# EAGLE design Basic_health_version_II (EAGLE 8.2.2)
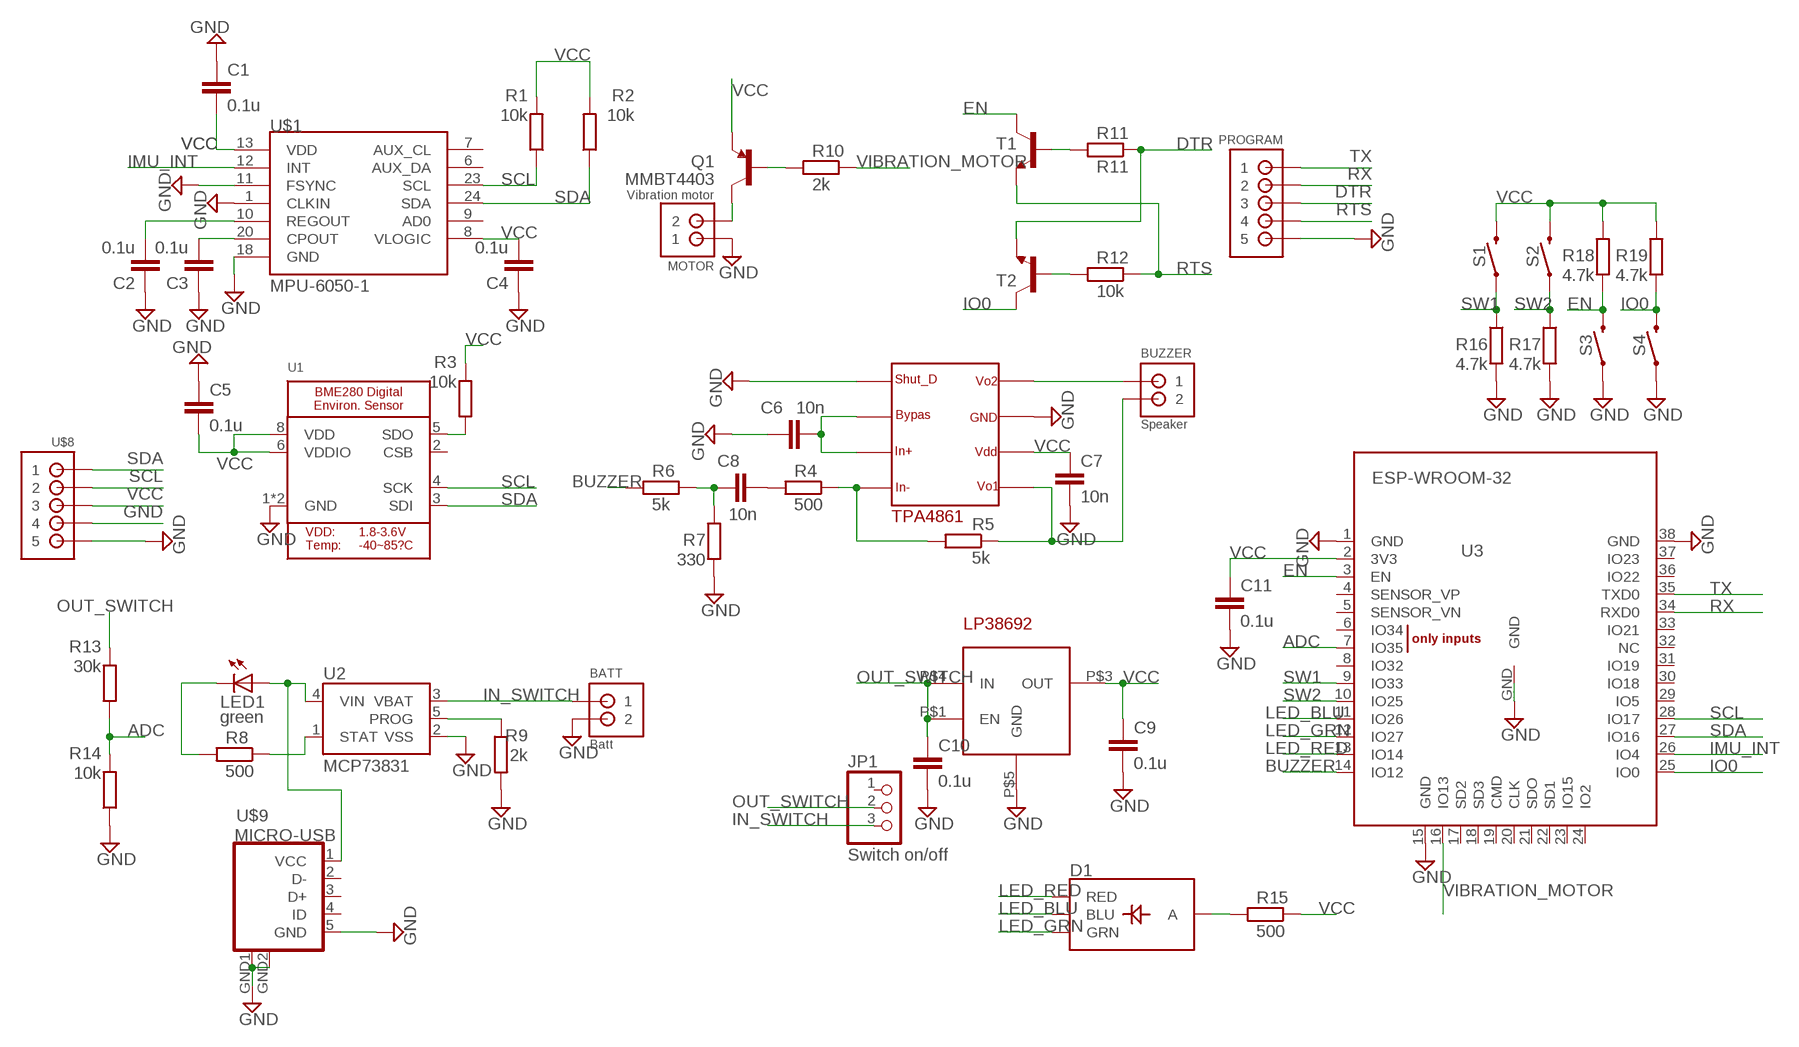
[diagram p0: schematic, sheet 1]

## Parts
BATT  Batt  JST-PH_2-PIN_HEADER  [JST_B2B-PH_HEADER]
BUZZER  Speaker  JST-PH_2-PIN_HEADER  [JST_B2B-PH_HEADER]
C1  0.1u  C-EUC0603K  [C0603K]
C2  0.1u  C-EUC0603K  [C0603K]
C3  0.1u  C-EUC0603K  [C0603K]
C4  0.1u  C-EUC0603K  [C0603K]
C5  0.1u  C-EUC0603K  [C0603K]
C6  10n  C-EUC0603K  [C0603K]
C7  10n  C-EUC0603K  [C0603K]
C8  10n  C-EUC0603K  [C0603K]
C9  0.1u  C-EUC0603K  [C0603K]
C10  0.1u  C-EUC0603K  [C0603K]
C11  0.1u  C-EUC0603K  [C0603K]
D1  LED-RGB-CASMD  [LED-TRICOLOR-SMD]
JP1  Switch on/off  PINHD-1X3  [1X03]
LED1  green  LEDCHIPLED_0805  [CHIPLED_0805]
MOTOR  Vibration motor  JST-PH_2-PIN_HEADER  [JST_B2B-PH_HEADER]
PROGRAM  Program port  JST-PH_5-PIN_HEADER  [JST_B5B-PH_HEADER]
Q1  MMBT4403  TRANSISTOR_PNPMMBT4403  [SOT23-3]
R1  10k  R-EU_R0603  [R0603]
R2  10k  R-EU_R0603  [R0603]
R3  10k  R-EU_R0603  [R0603]
R4  500  R-EU_R0603  [R0603]
R5  5k  R-EU_R0603  [R0603]
R6  5k  R-EU_R0603  [R0603]
R7  330  R-EU_R0603  [R0603]
R8  500  R-EU_R0603  [R0603]
R9  2k  R-EU_R0603  [R0603]
R10  2k  R-EU_R0603  [R0603]
R11  R11  R-EU_R0603  [R0603]
R12  10k  R-EU_R0603  [R0603]
R13  30k  R-EU_R0603  [R0603]
R14  10k  R-EU_R0603  [R0603]
R15  500  R-EU_R0603  [R0603]
R16  4.7k  R-EU_R0603  [R0603]
R17  4.7k  R-EU_R0603  [R0603]
R18  4.7k  R-EU_R0603  [R0603]
R19  4.7k  R-EU_R0603  [R0603]
S1  MOMENTARY-SWITCH-SPST-PTH-RIGHT-ANGLE  [TACTILE_SWITCH_PTH_RIGHT_ANGLE]
S2  MOMENTARY-SWITCH-SPST-PTH-RIGHT-ANGLE  [TACTILE_SWITCH_PTH_RIGHT_ANGLE]
S3  MOMENTARY-SWITCH-SPST-PTH-RIGHT-ANGLE  [TACTILE_SWITCH_PTH_RIGHT_ANGLE]
S4  MOMENTARY-SWITCH-SPST-PTH-RIGHT-ANGLE  [TACTILE_SWITCH_PTH_RIGHT_ANGLE]
T1  BC817-16-NPN-SOT23-BEC  [SOT23-BEC]
T2  BC817-16-NPN-SOT23-BEC  [SOT23-BEC]
U1  BME280  [BME280]
U2  MCP73831  [SOT23-5]
U3  ESP-WROOM-32  [ESP-WROOM-32]
U$1  MPU-6050-1  [QFN-24-4MM2]
U$2  TPA4861  [SOIC8]
U$5  LP38692_3.3V  [SOT-223-4]
U$8  JST-PH_5-PIN_HEADER  [JST_B5B-PH_HEADER]
U$9  MICRO-USB  [MICRO-USB]

## Nets
ADC: R13.1 R14.2 U3.7(IO35)
BUZZER: R6.2 U3.14(IO12)
DTR: PROGRAM.P3 R11.1 T2.E
EN: R18.2 S3.2 T1.C U3.3(EN)
GND: BATT.P2 C1.1 C2.1 C3.1 C4.1 C5.1 C6.2 C7.2 C9.2 C10.2 C11.2 MOTOR.P1 PROGRAM.P5 R7.2 R9.2 R14.1 R16.2 R17.2 S3.1 S4.1 U1.1(GND) U1.7(GND) U2.2(VSS) U3.1(GND) U3.15(GND) U3.38(GND) U3.GND U$1.1(CLKIN) U$1.11(FSYNC) U$1.18(GND) U$2.P$1 U$2.P$7 U$5.P$5(GND) U$8.P4 U$8.P5 U$9.5(GND) U$9.GND1(GND) U$9.GND2(GND)
IMU_INT: U3.26(IO4) U$1.12(INT)
IN_SWITCH: BATT.P1 JP1.3 U2.3(VBAT)
IO0: R19.2 S4.2 T2.C U3.25(IO0)
LED_BLU: D1.B(BLU) U3.11(IO26)
LED_GRN: D1.G(GRN) U3.12(IO27)
LED_RED: D1.R(RED) U3.13(IO14)
N$2: C6.1 U$2.P$2 U$2.P$3
N$3: R3.1 U1.5(SDO)
N$5: C3.2 U$1.20(CPOUT)
N$6: C2.2 U$1.10(REGOUT)
N$7: R4.1 R5.2 U$2.P$4
N$8: C8.2 R4.2
N$10: BUZZER.P2 R5.1 U$2.P$5
N$11: BUZZER.P1 U$2.P$8
N$12: C8.1 R6.1 R7.1
N$13: LED1.A U2.4(VIN) U$9.1(VCC)
N$14: LED1.C R8.2
N$15: R8.1 U2.1(STAT)
N$16: R9.1 U2.5(PROG)
N$17: Q1.1(B) R10.2
N$18: MOTOR.P2 Q1.3(C)
N$19: R12.2 T2.B
N$20: R11.2 T1.B
N$21: D1.A R15.2
OUT_SWITCH: C10.1 JP1.2 R13.2 U$5.P$1(EN) U$5.P$4(IN)
RTS: PROGRAM.P4 R12.1 T1.E
RX: PROGRAM.P2 U3.34(RXD0)
SCL: R1.1 U1.4(SCK) U3.28(IO17) U$1.23(SCL) U$8.P2
SDA: R2.1 U1.3(SDI) U3.27(IO16) U$1.24(SDA) U$8.P1
SW1: R16.1 S1.1 U3.9(IO33)
SW2: R17.1 S2.1 U3.10(IO25)
TX: PROGRAM.P1 U3.35(TXD0)
VCC: C1.2 C4.2 C5.2 C7.1 C9.1 C11.1 Q1.2(E) R1.2 R2.2 R3.2 R15.1 R18.1 R19.1 S1.2 S2.2 U1.6(VDDIO) U1.8(VDD) U3.2(3V3) U$1.8(VLOGIC) U$1.13(VDD) U$2.P$6 U$5.P$3(OUT) U$8.P3
VIBRATION_MOTOR: R10.1 U3.16(IO13)
Unconnected: JP1.1 U1.2(CSB) U3.4(SENSOR_VP) U3.5(SENSOR_VN) U3.6(IO34) U3.8(IO32) U3.17(SD2) U3.18(SD3) U3.19(CMD) U3.20(CLK) U3.21(SDO) U3.22(SD1) U3.23(IO15) U3.24(IO2) U3.29(IO5) U3.30(IO18) U3.31(IO19) U3.32(NC) U3.33(IO21) U3.36(IO22) U3.37(IO23) U$1.6(AUX_DA) U$1.7(AUX_CL) U$1.9(AD0) U$9.2(D-) U$9.3(D+) U$9.4(ID)

## Library data of the parts
BATT BUZZER MOTOR = srg:JST-PH_2-PIN_HEADER: 2-pin JST PH Shrouded Header, top entry P/N B2B-PH-K-S Mating connector PHR-2 Mating cable assembly: Sparkfun PRT-09914 <http://www.sparkfun.com/products/9914>
C1-C11 = rcl:C-EU: CAPACITOR, European symbol; SPICEPREFIX: C
D1 = SparkFun-LED:LED-RGB-CA: LED-RGB Diffused Common Anode Packages: LED RGB-THRU P-LCC-4-3 LED-TRICOLOR-SMD SparkFun Products: RGB Diffused Common Anode- Diffuse <[https://www.sparkfun.com/products/10821]> RGB Diffused Common Anode - Clear <[https://www.sparkfun.com/products/10820]> Qduino Mini <[https://www.sparkfun.com/products/13614]> Triple Output LED RGB - SMD <https://www.sparkfun.com/products/7844>; PROD_ID: DIO-08324
JP1 = pinhead:PINHD-1X3: PIN HEADER
LED1 = led:LED: LED OSRAM: - CHIPLED LG R971, LG N971, LY N971, LG Q971, LY Q971, LO R971, LY R971 LH N974, LH R974 LS Q976, LO Q976, LY Q976 LO Q996 - Hyper CHIPLED LW Q18S LB Q993, LB Q99A, LB R99A - SideLED LS A670, LO A670, LY A670, LG A670, LP A670 LB A673, LV A673, LT A673, LW A673 LH A674 LY A675 LS A676, LA A676, LO A676, LY A676, LW A676 LS A679, LY A679, LG A679 - Hyper Micro SIDELED® LS Y876, LA Y876, LO Y876, LY Y876 LT Y87S - SmartLED LW L88C, LW L88S LB L89C, LB L89S, LG L890 LS L89K, LO L89K, LY L89K LS L896, LA L896, LO L896, LY L896 - TOPLED LS T670, LO T670, LY T670, LG T670, LP T670 LSG T670, LSP T670, LSY T670, LOP T670, LYG T670 LG T671, LOG T671, LSG T671 LB T673, LV T673, LT T673, LW T673 LH T674 LS T676, LA T676, LO T676, LY T676, LB T676, LH T676, LSB T676, LW T676 LB T67C, LV T67C, LT T67C, LS T67K, LO T67K, LY T67K, LW E67C LS E67B, LA E67B, LO E67B, LY E67B, LB E67C, LV E67C, LT E67C LW T67C LS T679, LY T679, LG T679 LS T770, LO T770, LY T770, LG T770, LP T770 LB T773, LV T773, LT T773, LW T773 LH T774 LS E675, LA E675, LY E675, LS T675 LS T776, LA T776, LO T776, LY T776, LB T776 LHGB T686 LT T68C, LB T68C - Hyper Mini TOPLED® LB M676 - Mini TOPLED Santana® LG M470 LS M47K, LO M47K, LY M47K Source: http://www.osram.convergy.de LUXEON: - LUMILED® LXK2-PW12-R00, LXK2-PW12-S00, LXK2-PW14-U00, LXK2-PW14-V00 LXK2-PM12-R00, LXK2-PM12-S00, LXK2-PM14-U00 LXK2-PE12-Q00, LXK2-PE12-R00, LXK2-PE12-S00, LXK2-PE14-T00, LXK2-PE14-U00 LXK2-PB12-K00, LXK2-PB12-L00, LXK2-PB12-M00, LXK2-PB14-N00, LXK2-PB14-P00, LXK2-PB14-Q00 LXK2-PR12-L00, LXK2-PR12-M00, LXK2-PR14-Q00, LXK2-PR14-R00 LXK2-PD12-Q00, LXK2-PD12-R00, LXK2-PD12-S00 LXK2-PH12-R00, LXK2-PH12-S00 LXK2-PL12-P00, LXK2-PL12-Q00, LXK2-PL12-R00 Source: www.luxeon.com KINGBRIGHT: KA-3528ASYC Source: www.kingbright.com
PROGRAM U$8 = srg:JST-PH_5-PIN_HEADER: 5-pin JST PH Shrouded Header, top entry P/N B5B-PH-K-S Mating connector PHR-5 Mating cable assembly: Sparkfun PRT-09917 <http://www.sparkfun.com/products/9917>
Q1 = SparkFun-DiscreteSemi:TRANSISTOR_PNP: Generic PNP BJT Double check pinouts against datasheets- not all devices are the same! MMBT3906 - 40V 200mA SOT-23 (TRANS-08052) MMBT4403 - 40V 600mA SOT-23 (TRANS-09245); PROD_ID: TRANS-09245
R1-R19 = rcl:R-EU_: RESISTOR, European symbol; SPICEPREFIX: R
S1-S4 = SparkFun-Switches:MOMENTARY-SWITCH-SPST: Momentary Switch (Pushbutton) - SPST Normally-open (NO) SPST momentary switches (buttons, pushbuttons). Variants PTH-12MM - 12mm square, through-hole Momentary Pushbutton Switch - 12mm Square <https://www.sparkfun.com/products/9190> (COM-09190) PTH-6.0MM, PTH-6.0MM-KIT - 6.0mm square, through-hole Mini Pushbutton Switch <https://www.sparkfun.com/products/97> (COM-00097) KIT package intended for soldering kit's - only one side of pads' copper is exposed. PTH-RIGHT-ANGLE-KIT - Right-angle, through-hole Right Angle Tactile Button <https://www.sparkfun.com/products/10791> - Used on SparkFun BigTime Watch Kit <https://www.sparkfun.com/products/11734> SMD-12MM - 12mm square, surface-mount Tactile Button - SMD (12mm) <https://www.sparkfun.com/products/12993> (COM-12993) Used on SparkFun PicoBoard <https://www.sparkfun.com/products/11888> SMD-4.5MM - 4.5mm Square Trackball Switch Used on SparkFun Blackberry Trackballer Breakout <https://www.sparkfun.com/products/13169> SMD-4.6MMX2.8MM - 4.60mm x 2.80mm, surface mount Used on SparkFun SAMD21 Mini Breakout <https://www.sparkfun.com/products/13664> SMD-5.2MM, SMD-5.2-REDUNDANT - 5.2mm square, surface-mount Mini Pushbutton Switch - SMD <https://www.sparkfun.com/products/8720> (COM-08720) Used on Arduino Pro Mini <https://www.sparkfun.com/products/11114> REDUNDANT package connects both switch circuits together SMD-6.0X3.5MM - 6.0 x 3.5mm, surface mount Momentary Reset Switch SMD <https://www.sparkfun.com/products/8229> (COM-08229) SMD-6.2MM-TALL - 6.2mm square, surface mount Tactile Button - SMD (6mm) <https://www.sparkfun.com/products/12992> Used on SparkFun Digital Sandbox <https://www.sparkfun.com/products/12651> SMD-RIGHT-ANGLE - Right-angle, surface mount Used on SparkFun Block for Intel® Edison - Arduino <https://www.sparkfun.com/products/13036>; PROD_ID: CONN-10672; SF_SKU: COM-10791
T1 T2 = transistor:*-NPN-: NPN Transistror BF959 corrected 2008.03.06
U1 = BMP280:BME280: BME280 - Environmental Sensor (I2C + SPI)
U2 = SparkFun-IC-Power:MCP73831: MCP73831T Li-Ion, Li-Pol Controller Miniature single cell, fully integrated Li-Ion, Li-polymer charge management controller Datasheet <http://ww1.microchip.com/downloads/en/DeviceDoc/20001984g.pdf> SparkFun Products: SparkFun ESP32 Thing <https://www.sparkfun.com/products/13907> SparkFun 9DoF Razor IMU M0 <https://www.sparkfun.com/products/14001>; PROD_ID: IC-09995
U3 = esp32:ESP-WROOM-32
U$1 = mpu6050:MPU-6050
U$2 = TPA4861:TPA4861
U$5 = LP38692:LP38692_3.3V
U$9 = microusb:MICRO-USB: Micro USB B connector

## Board
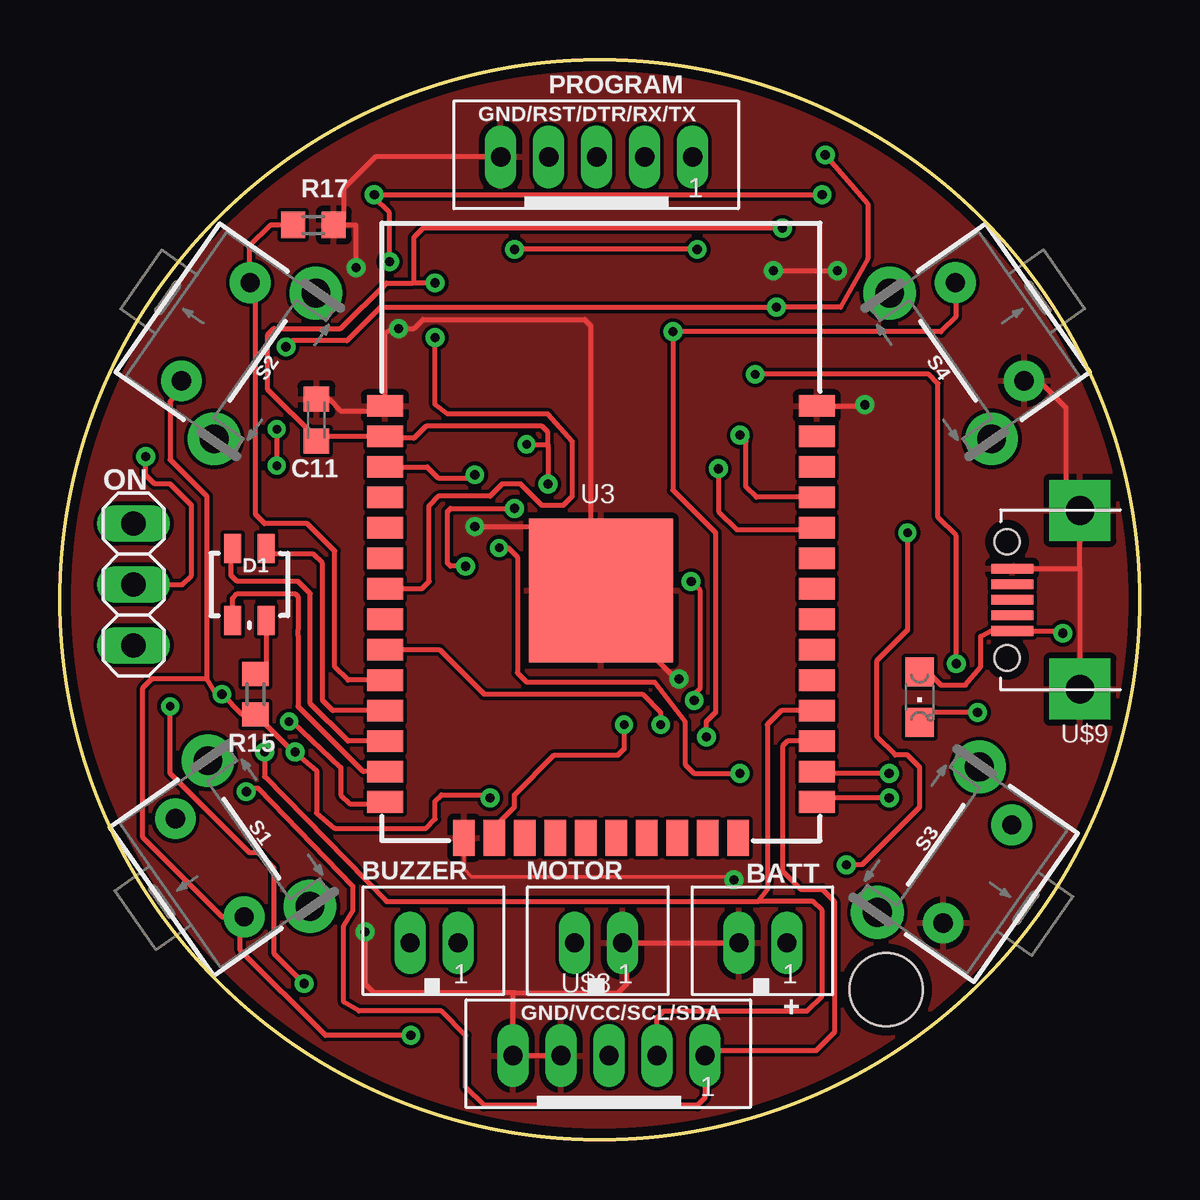
[diagram p1: board, top side]
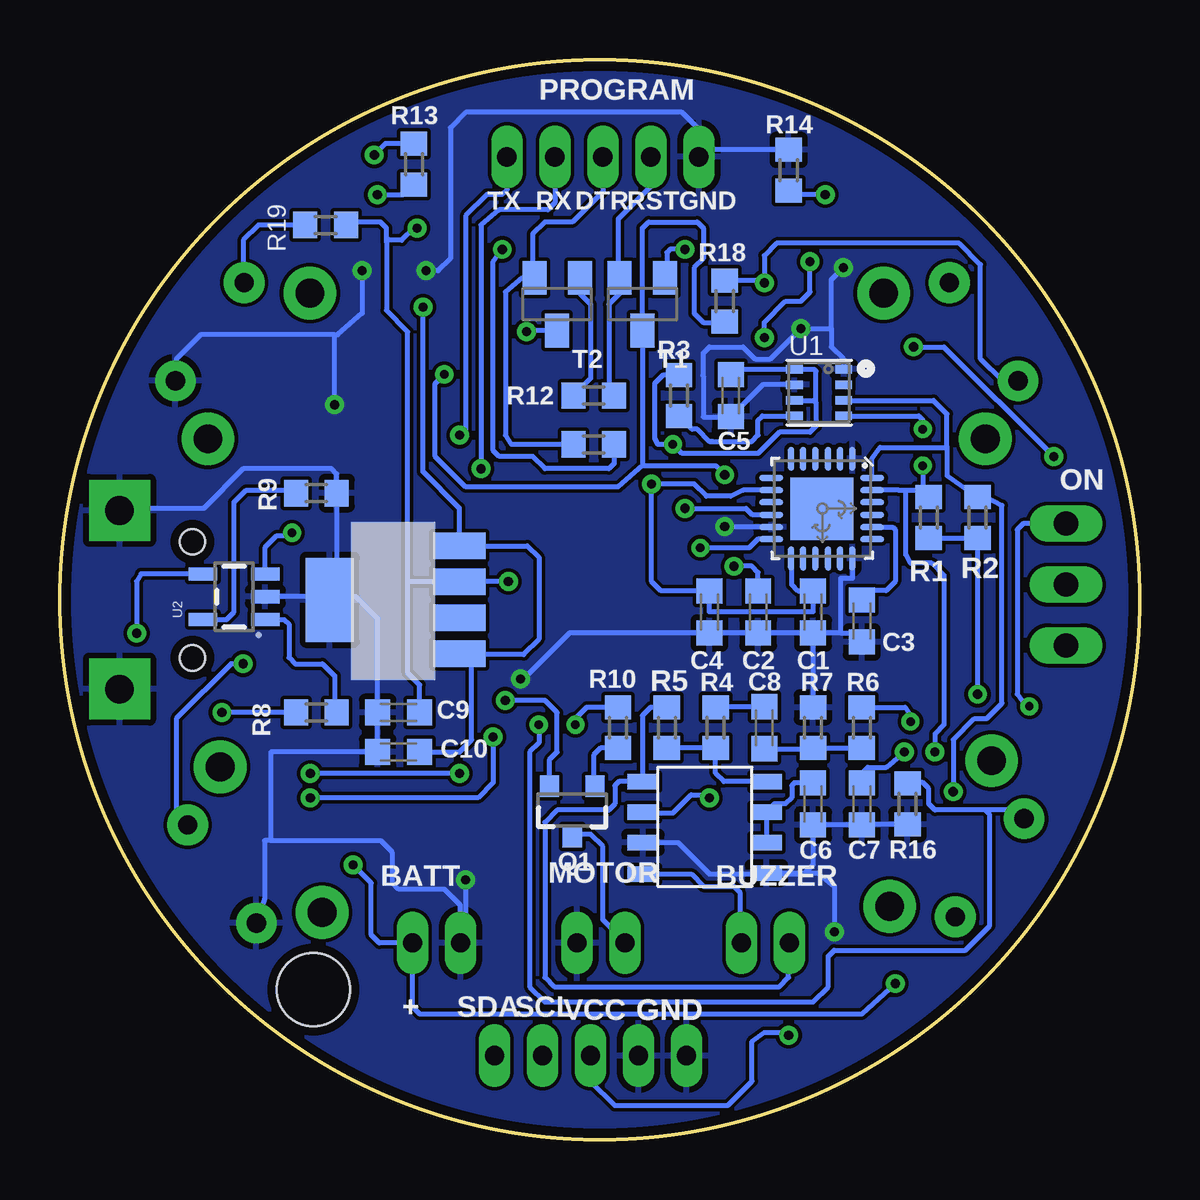
[diagram p2: board, bottom side, seen from below]

Size 45 x 45 mm. Coordinates in mm from the lower left corner, seen from the top.
Outline: circle at 22.5,22.5 radius 22.5
Copper layers (1*16): Top 0.035mm / dielectric 1.5mm / Bottom 0.035mm
Design rules "default *": minimum track width 6mil, minimum drill 0.35mm, track to track 6mil, track to pad 6mil, pad to pad 6mil, via to via 6mil, smd to smd 6mil, copper to edge 15mil, drill to drill 6mil, minimum pad ring 10mil, minimum via ring 8mil, stop-mask expansion 4mil, vias tented up to drill 0mil, thermal gap 10mil
Holes 3.05 mm at 34.44,6.24

### Footprints (pad centres in the part's own frame; a part is rotated, then mirrored left to right if it is on the bottom)
JST_B2B-PH_HEADER = drill 0.8 long: P1 1.075,0.048; P2 -0.925,0.048
C0603K = smd 1.05 x 1.08: 1 -0.875,0; 2 0.875,0
LED-TRICOLOR-SMD = smd 1.2 x 0.7: A 1.5,0.7; B -1.5,0.7; G -1.5,-0.7; R 1.5,-0.7
1X03 = drill 1.016 long: 1 -2.54,0; 2 0,0; 3 2.54,0
CHIPLED_0805 = smd 1.2 x 1.2: A 0,-1.05; C 0,1.05
JST_B5B-PH_HEADER = drill 0.8 long: P1 4,0.048; P2 2,0.048; P3 0,0.048; P4 -2,0.048; P5 -4,0.048
SOT23-3 = smd 0.8 x 0.9: 1 -0.95,-1; 2 0.95,-1; 3 0,1.1
R0603 = smd 1 x 1.1: 1 -0.85,0; 2 0.85,0
TACTILE_SWITCH_PTH_RIGHT_ANGLE = drill 0.8 pad 1.7: 1 -2.5,0; 2 2.5,0 | drill 1.2 pad 2.2: ANCHOR1 -3.703,2.5; ANCHOR2 3.703,2.5
SOT23-BEC = smd 1 x 1.4: B -0.95,-1.1; C 0,1.1; E 0.95,-1.1
BME280 = smd 0.7 x 0.35: 1 1.025,0.975; 2 1.025,0.325; 3 1.025,-0.325; 4 1.025,-0.975; 5 -1.025,-0.975; 6 -1.025,-0.325; 7 -1.025,0.325; 8 -1.025,0.975
SOT23-5 = smd 0.55 x 1.2: 1 -0.95,-1.3; 2 0,-1.3; 3 0.95,-1.3; 4 0.95,1.3; 5 -0.95,1.3
ESP-WROOM-32 = smd 0.9 x 1.5: 1 7.7,9; 2 6.43,9; 3 5.16,9; 4 3.89,9; 5 2.62,9; 6 1.35,9; 7 0.08,9; 8 -1.19,9; 9 -2.46,9; 10 -3.73,9; 11 -5,9; 12 -6.27,9; 13 -7.54,9; 14 -8.81,9; 25 -8.81,-9; 26 -7.54,-9; 27 -6.27,-9; 28 -5,-9; 29 -3.73,-9; 30 -2.46,-9; 31 -1.19,-9; 32 0.08,-9; 33 1.35,-9; 34 2.62,-9; 35 3.89,-9; 36 5.16,-9; 37 6.43,-9; 38 7.7,-9 | smd 1.5 x 0.9: 15 -10.3,5.715; 16 -10.3,4.445; 17 -10.3,3.175; 18 -10.3,1.905; 19 -10.3,0.635; 20 -10.3,-0.635; 21 -10.3,-1.905; 22 -10.3,-3.175; 23 -10.3,-4.445; 24 -10.3,-5.715 | smd 6 x 6: GND 0,0
QFN-24-4MM2 = smd 1.016 x 0.254: 1 -2.066,1.257; 2 -2.066,0.75; 3 -2.066,0.247; 4 -2.066,-0.287; 5 -2.066,-0.792; 6 -2.066,-1.297; 13 2.086,-1.297; 14 2.086,-0.792; 15 2.086,-0.287; 16 2.086,0.247; 17 2.086,0.75; 18 2.086,1.257 | smd 0.254 x 1.016: 7 -1.267,-2.122; 8 -0.762,-2.122; 9 -0.258,-2.122; 10 0.278,-2.122; 11 0.78,-2.122; 12 1.287,-2.122; 19 1.287,2.082; 20 0.78,2.082; 21 0.278,2.082; 22 -0.258,2.082; 23 -0.762,2.082; 24 -1.267,2.082 | smd 2.616 x 2.616: P$1 0.02,-0.01
SOIC8 = smd 1.3 x 0.65: P$1 -0.6,4.405; P$2 -0.6,3.135; P$3 -0.6,1.865; P$4 -0.6,0.595; P$5 4.55,0.595; P$6 4.55,1.865; P$7 4.55,3.135; P$8 4.55,4.45
SOT-223-4 = smd 1.1 x 2.2: P$1 -2.25,-1; P$2 -0.75,-1; P$3 0.75,-1; P$4 2.25,-1 | smd 3.5 x 2: P$5 0,4.4
MICRO-USB = smd 0.4 x 1.75: 1 -1.3,4.525; 2 -0.65,4.525; 3 0,4.525; 4 0.65,4.525; 5 1.3,4.525 | drill 1.2 pad 2.54 square: GND1 -3.725,1.7; GND2 3.725,1.7 | hole 1.05: -2.425,4.73; 2.425,4.73

### Placement (x,y rotation side)
BATT  29.23,8.15 0 top
BUZZER  15.52,8.15 0 top
C1  13.61,21.99 90 bottom
C2  15.9,21.99 90 bottom
C3  11.58,21.61 90 bottom
C4  17.93,21.99 90 bottom
C5  17.04,31.01 90 bottom
C6  13.61,13.99 270 bottom
C7  11.58,13.99 270 bottom
C8  15.64,17.17 90 bottom
C9  30.88,17.8 180 bottom
C10  30.88,16.15 180 bottom
C11  10.69,29.99 90 top
D1  7.9,23.14 270 top
JP1  3.07,23.14 90 top
LED1  35.84,18.44 180 top
MOTOR  22.37,8.15 0 top
PROGRAM  22.37,40.91 0 top
Q1  23.64,13.74 180 bottom
R1  8.78,25.93 270 bottom
R2  6.75,25.93 270 bottom
R3  19.2,31.01 90 bottom
R4  17.67,17.17 90 bottom
R5  19.71,17.17 270 bottom
R6  11.58,17.17 90 bottom
R7  13.61,17.17 90 bottom
R8  34.31,17.8 180 bottom
R9  34.31,26.95 0 bottom
R10  21.74,17.17 270 bottom
R11  22.75,28.98 0 bottom
R12  22.75,31.01 180 bottom
R13  30.25,40.66 90 bottom
R14  14.63,40.41 270 bottom
R15  8.15,18.56 90 top
R16  9.67,13.99 270 bottom
R17  10.56,38.12 0 top
R18  17.29,34.95 270 bottom
R19  33.93,38.12 180 bottom
S1  6.24,11.32 305 top
S2  6.5,33.68 235 top
S3  38.25,11.07 55 top
S4  38.76,33.68 125 top
T1  20.72,34.82 180 bottom
T2  24.28,34.82 180 bottom
U1  13.36,31.14 0 bottom
U2  37.74,22.63 90 bottom
U3  22.55,22.88 90 top
U$1  13.23,26.31 270 bottom
U$2  16.15,15.52 180 bottom
U$5  29.36,22.5 90 bottom
U$8  22.88,3.45 0 top
U$9  44.22,22.5 90 top

### Tracks (layer width: path | path; a pad name or v marks a point on that pad's centre or on a via)
ADC  (via drill 0.38 pad 0.76)
  Top 0.203: U3.7 15.09,22.96 15.39,23.26 15.39,26.44 15.77,26.82 17.93,26.82 18.44,27.33 19.2,27.33 20.09,26.44 20.98,26.44 21.36,26.82 21.36,29.1 20.34,30.25 16.15,30.25 15.64,30.63 v15.64,33.42 | v13.74,36.6 13.74,38.63 13.1,39.26 v13.1,39.39 v31.77,39.39
  Bottom 0.203: v15.64,33.42 15.64,34.06 14.75,34.95 14.12,34.95 13.74,35.33 v13.74,36.6 | v13.1,39.39 14.46,39.39 R14.2 | v31.77,39.39 30.67,39.39 R13.1
BUZZER  (via drill 0.35)
  Top 0.203: v9.55,17.42 9.67,17.42 11.71,15.52 11.71,14.37 12.09,13.99 13.47,13.99 U3.14
  Bottom 0.203: R6.2 9.76,18.02 9.55,17.67 v9.55,17.42
DTR
  Bottom 0.203: PROGRAM.P3 22.37,39.52 23.64,38.25 24.79,38.25 25.29,37.74 25.29,35.98 T2.E 25.72,35.92 26.44,35.33 26.44,29.36 26.18,28.98 R11.1
EN  (via drill 0.35, 0.38 pad 0.76)
  Top 0.203: v17.29,27.71 17.17,27.71 17.04,27.58 15.77,27.58 15.31,28.04 U3.3 | v37.36,19.83 37.36,25.17 36.6,25.93 36.6,31.52 36.22,31.9 v28.98,31.9 28.85,31.9
  Bottom 0.203: 20.35,34.1 T1.C | v17.29,27.71 17.67,28.09 20.72,28.09 | 20.72,28.09 21.74,27.2 28.09,27.2 29.36,28.47 29.36,31.52 v28.98,31.9 | T1.C 20.72,28.09 | S3.2 40.15,13.59 40.15,17.55 37.87,19.83 v37.36,19.83 | R18.2 17.33,34.06 18.18,34.06 18.56,34.44 18.56,36.34 18.18,36.72 18.18,37.99 18.44,38.25 20.47,38.25 20.72,37.99 T1.C
GND  (via drill 0.38 pad 0.76)
  Top 0.152: U3.15 16.84,11.27 17.17,10.94 27.83,10.94 v28.09,10.82
  Top 0.203: U3.GND 22.75,23.08 22.75,24.66 21.87,25.55 v17.29,25.55 | C11.2 11.21,30.87 11.71,30.37 13.34,30.37 U3.1 | 11.58,38.12 R17.2 | 11.58,38.12 12.33,38.12 12.34,38.12 v12.34,36.34 | 13.36,30.78 U3.1 | S4.1 40.8,31.63 41.93,30.5 41.93,27.07 U$9.GND2 | U3.38 31.63,30.58 | 42.73,26.18 U$9.GND2 | PROGRAM.P5 13.15,40.96 11.83,39.65 11.83,38.37 11.58,38.12 | U3.GND 22.17,23.26 22.12,23.26 22.12,33.93 21.87,34.18 15.13,34.18 14.75,33.8 v14.12,33.8 13.86,33.8 13.55,33.62 U3.1 | v12.72,8.66 12.72,6.5 13.1,6.12 18.95,6.12 | 18.95,6.12 23.26,6.12 23.64,6.5 23.64,8 MOTOR.P1 BATT.P2 | v25.8,19.2 25.68,19.2 23.9,20.98 23.9,21.54 U3.GND | 31.64,30.6 31.63,30.58 | v29.74,36.22 v32.41,36.22 | v33.55,30.63 33.55,30.5 33.47,30.58 31.63,30.58 | U$8.P4 U$8.P5 18.88,6.05 18.95,6.12 | 42.52,23.79 U$9.GND2 | 42.52,23.79 U$9.GND1 | U$9.5 42.51,23.8 42.52,23.79
  Bottom 0.203: U1.7 15.7,31.46 16.53,30.63 16.55,30.63 C5.1 18.18,30.12 18.18,31.82 | 12.47,21.12 C1.1 | R16.2 11.55,13.14 C7.2 C6.2 13.61,11.45 13.99,11.07 15.51,11.07 | 15.51,11.07 U$2.P$1 13.4,11.11 12.72,10.56 v12.72,8.66 | U$2.P$7 19.24,12.38 17.93,11.07 15.51,11.07 | C1.1 C2.1 C4.1 23.76,21.12 25.68,19.2 v25.8,19.2 | U$1.11 17.28,25.53 | C1.1 R7.2 | 42.69,18.69 U$9.GND1 | 33.96,22.63 U2.2 | 33.96,22.63 33.89,22.63 U$5.P$5 33.63,22.63 32.66,22.63 31.76,21.72 C9.2 C10.2 36.22,16.15 36.22,12.48 36.2,12.47 | R9.2 33.46,23.12 33.96,22.63 | R9.2 33.46,27.75 33.68,27.96 37.36,27.96 39.01,26.31 42.69,26.31 U$9.GND2 | 17.39,25.42 17.28,25.53 | v17.29,25.55 17.28,25.53 | U1.1 12.33,32.52 12.85,33.04 12.85,33.82 | 18.18,31.82 18.18,32.79 17.93,33.04 16.53,33.04 16.02,32.53 15.39,32.53 v14.12,33.8 12.87,33.8 12.85,33.82 | 18.22,31.86 18.18,31.82 | 18.37,41.42 PROGRAM.P5 | 18.37,41.42 18.37,42.12 19.07,42.82 28.09,42.82 28.72,42.19 28.72,36.72 29.23,36.22 v29.74,36.22 | 33.42,26.98 R9.2 | 12.85,33.82 12.85,35.84 v12.34,36.34 | 36.2,12.47 31.64,12.47 31.14,11.96 31.14,10.69 30.88,10.44 28.98,10.44 28.31,9.76 BATT.P2 28.09,8.41 v28.09,10.82 | 36.2,12.47 36.47,12.47 36.47,10.03 S3.1 | v32.41,36.22 32.41,34.44 33.42,33.55 33.56,33.55 | 33.56,33.55 39.14,33.55 40.15,32.53 40.15,31.66 S4.1 | v33.55,30.63 33.55,33.54 33.56,33.55 | R14.1 18.21,41.26 18.37,41.42 | 11.96,24.21 U$1.18 11.96,24.22 11.96,23.39 12.47,23.39 12.47,21.12 | 12.47,21.12 11.83,21.12 C3.1
  pour Bottom: 22.25,44.98 22.37,44.98 arc-90 44.98,22.37 arc-90 22.63,0.02 22.5,0.02 arc-90 0.15,22.37 0.15,23.01 arc-90 22.12,44.98
  pour Top: 21.36,44.98 22.37,44.98 arc-90 45.11,22.25 arc-95 20.85,0.15 arc-85 0.02,23.26 arc-88
IMU_INT  (via drill 0.35, 0.38 pad 0.76)
  Top 0.203: v18.31,24.66 18.69,24.66 19.07,24.28 19.07,19.45 19.45,19.07 24.79,19.07 26.06,17.42 26.06,15.64 26.44,15.26 v28.34,15.26 | v34.56,15.26 31.63,15.26 U3.26
  Bottom 0.203: U$1.12 15.91,25.02 16.28,24.66 v18.31,24.66 | v28.34,15.26 v34.56,15.26
IN_SWITCH  (via drill 0.35, 0.38 pad 0.76)
  Top 0.203: v35.33,25.29 35.33,21.23 34.06,19.96 34.06,16.79 34.82,16.02 35.33,16.02 35.84,15.52 35.84,13.86 33.42,11.45 v32.79,11.45 | 4.72,17.93 v4.59,18.05 4.59,15.26 7.9,11.96 8.28,11.96 8.91,11.32 8.91,7.77 v10.18,6.5
  Bottom 0.203: U2.3 36.44,24.69 35.96,25.17 35.45,25.17 v35.33,25.29 | JP1.3 4.85,25.68 5.1,25.42 5.1,18.56 4.72,18.05 v4.59,18.05 | v10.18,6.5 11.58,5.23 29.99,5.23 30.31,5.54 BATT.P1 | 30.51,8.4 BATT.P1 | BATT.P1 31.69,8.2 32.03,8.53 32.03,10.69 v32.79,11.45
IO0  (via drill 0.38 pad 0.76)
  Top 0.203: v34.56,14.25 31.73,14.25 U3.25 | S4.2 37.36,35.69 37.36,34.31 36.72,33.68 v25.55,33.68 25.55,27.07 27.33,25.29 27.33,17.8 26.95,17.42 v26.95,16.79
  Bottom 0.203: T2.C 25.38,33.72 v25.55,33.68 | R19.2 36.72,38.12 37.36,37.49 37.36,35.76 S4.2 | v26.95,16.79 26.95,14.88 27.58,14.25 v34.56,14.25
LED_BLU
  Top 0.203: U3.11 11.37,17.88 10.94,18.31 10.94,24.02 10.56,24.41 8.83,24.41 D1.B
LED_GRN
  Top 0.203: U3.12 12.01,16.61 10.44,18.18 10.44,22.75 9.93,23.26 7.39,23.26 7.13,23.52 7.13,24.57 D1.G
LED_RED
  Top 0.203: U3.13 12.64,15.34 9.93,18.05 9.93,21.03 9.93,21.23 9.93,22.63 9.8,22.75 7.39,22.75 7.2,22.56 D1.R
N$2
  Bottom 0.203: U$2.P$2 U$2.P$3 15.21,13.99 14.75,13.99 14.5,14.25 14.5,14.75 14.39,14.87 C6.1
N$3
  Bottom 0.203: U1.5 15.73,30.16 15.9,29.99 15.9,29.36 16.15,29.1 17.8,29.1 | 17.93,29.1 17.8,29.1 | 17.8,29.1 17.93,29.1 | 17.93,29.1 18.44,29.61 18.65,29.61 R3.1
N$5
  Bottom 0.203: U$1.20 10.29,25.53 10.18,25.42 10.18,23.26 10.56,22.88 11.56,22.88 C3.2
N$6  (via drill 0.38 pad 0.76)
  Top 0.203: v16.91,23.9 16.28,23.9 16.15,24.02 16.15,26.18 16.28,26.31 v18.94,26.31
  Bottom 0.203: U$1.10 15.37,26.06 16.15,26.06 16.4,26.31 v18.94,26.31 | C2.2 15.9,23.64 16.15,23.9 16.79,23.9 16.91,23.77 v16.91,23.9
N$7
  Bottom 0.203: U$2.P$4 17.33,14.92 17.67,15.26 R4.1 R5.2
N$8
  Bottom 0.203: C8.2 17.65,18.04 R4.2
N$10
  Bottom 0.203: R5.1 20.38,18.02 20.72,17.67 20.72,14.94 U$2.P$5 21.7,14.92 21.87,14.75 21.87,13.99 22.12,13.74 24.28,13.74 24.79,13.23 24.79,6.75 24.41,6.37 15.01,6.37 14.63,6.75 14.63,8.16 BUZZER.P2
N$11
  Bottom 0.203: U$2.P$8 18.69,11.07 18.18,10.56 16.91,10.56 16.66,10.31 16.66,8.26 BUZZER.P1
N$12
  Bottom 0.203: C8.1 13.64,16.29 R7.1 R6.1
N$13  (via drill 0.38 pad 0.76)
  Top 0.203: 36.09,19.74 LED1.A 36.18,19.49 36.72,18.94 37.74,18.94 38.38,19.71 38.38,20.98 38.88,21.23 39.92,21.23 U$9.1 41.58,21.2 v41.8,21.1
  Bottom 0.203: U2.4 41.62,23.58 41.8,23.26 v41.8,21.1
N$14  (via drill 0.38 pad 0.76)
  Top 0.203: v38.25,17.8 36.25,17.8 LED1.C
  Bottom 0.203: R8.2 v38.25,17.8
N$15
  Bottom 0.203: U2.1 35.65,21.68 35.45,21.48 35.45,20.09 35.2,19.83 34.06,19.83 33.55,19.32 33.55,17.89 R8.1
N$16
  Bottom 0.203: U2.5 38.06,21.68 37.74,21.99 37.74,26.56 37.23,27.07 35.29,27.07 R9.1
N$17
  Bottom 0.203: R10.2 22.46,16.32 22.75,16.02 22.75,14.8 Q1.1
N$18
  Bottom 0.203: MOTOR.P2 21.45,8.24 22.37,9.17 22.37,12.21 22.88,12.72 23.56,12.72 Q1.3
N$19
  Bottom 0.203: T2.B 23.33,35.27 22.88,34.82 22.88,31.73 R12.2
N$20  (via drill 0.38 pad 0.76)
  Top 0.203: v26.56,37.11 v18.94,37.11
  Bottom 0.203: R11.2 21.9,28.18 22.12,27.96 24.79,27.96 25.29,28.47 26.69,28.47 26.95,28.72 26.95,36.6 v26.56,37.11 | v18.94,37.11 19.58,37.11 19.71,36.98 19.71,35.98 T1.B
N$21
  Top 0.203: D1.A 8.6,19.86 R15.2
OUT_SWITCH  (via drill 0.38 pad 0.76)
  Top 0.203: v9.42,33.04 9.67,33.3 11.96,33.3 13.36,34.69 v29.87,34.69 32.53,34.69 33.68,36.72 33.68,39.01 v31.9,41.04 | v3.58,28.47 3.58,27.71 3.96,27.33 4.59,27.33 5.48,26.44 5.48,23.52 5.1,23.14 JP1.2 3.2,23.01
  Bottom 0.203: C10.1 28.34,16.15 27.83,16.66 27.83,19.73 28.24,20.13 | 28.24,20.13 U$5.P$1 | v29.87,34.69 29.87,27.83 28.36,26.33 U$5.P$4 25.51,24.75 25.04,24.28 25.04,20.85 25.68,20.21 28.16,20.21 28.24,20.13 | v9.42,33.04 8.15,33.04 3.7,28.6 3.83,28.47 v3.58,28.47 | R13.2 31.43,41.51 v31.9,41.04
RTS
  Bottom 0.203: 21.67,35.73 T1.E | 21.67,35.73 21.67,35.27 22.12,34.82 22.12,31.22 R12.1 | PROGRAM.P4 20.37,39.74 21.74,38.38 21.74,35.79 21.67,35.73
RX  (via drill 0.38 pad 0.76)
  Top 0.203: v27.45,27.96 27.45,26.18 28.22,25.42 31.47,25.42 U3.34
  Bottom 0.203: PROGRAM.P2 24.37,39.04 24.66,38.76 26.69,38.76 27.45,38.12 v27.45,27.96
SCL  (via drill 0.35, 0.38 pad 0.76)
  Top 0.203: U3.28 30.07,17.88 29.49,17.29 29.49,10.44 29.1,9.93 | 29.1,9.93 13.61,9.93 8.53,15.13 v8.53,16.15 | v9.04,29.61 v9.04,28.09 | U$8.P2 24.88,5.07 25.17,5.36 31.14,5.36 31.77,5.99 31.77,9.55 31.39,9.93 29.1,9.93
  Bottom 0.203: 10.04,27.07 U$1.23 | 10.04,27.07 9.33,27.07 9.2,26.95 | 9.12,26.86 9.2,26.95 | 9.12,26.86 R1.1 8.91,26.95 9.2,26.95 | 10.04,27.07 9.75,27.06 9.75,24.38 9.55,24.02 8.66,24.02 8.15,23.52 8.15,17.29 8.53,16.91 v8.53,16.15 | U1.4 9.21,30.16 9.04,29.99 v9.04,29.61 | v9.04,28.09 9.04,26.94 9.12,26.86
SDA  (via drill 0.38 pad 0.76)
  Top 0.203: U3.27 30.33,16.61 30.12,16.4 30.12,11.2 30.88,10.44 31.77,10.44 32.28,9.93 32.28,4.47 31.52,3.7 27.09,3.7 U$8.P1 26.88,1.74 26.56,1.42 17.67,1.42 16.91,2.18 16.91,4.34 15.9,5.36 12.47,5.36 11.83,5.74 11.83,8.91 12.21,9.55 12.21,10.56 8.28,14.63 7.9,14.63 v7.77,14.5
  Bottom 0.203: U$1.24 11.15,28.39 10.82,28.85 8.05,28.85 8.02,28.88 | 8.02,28.88 8.02,30.25 8.59,30.81 U1.3 | 8.02,28.88 8.02,27.67 R2.1 7.09,26.82 6.5,26.82 5.74,26.44 5.74,18.18 6.37,17.55 6.88,17.55 7.77,16.66 v7.77,14.5
SW1  (via drill 0.35)
  Top 0.203: U3.9 15.82,20.42 17.67,18.56 24.28,18.56 25.04,17.8 v25.04,17.29
  Bottom 0.203: 6.43,13.74 4.74,13.74 S1.1 | 6.43,13.74 6.24,13.55 6.24,8.91 7.26,7.9 12.72,7.9 12.98,7.64 12.98,6.37 13.61,5.74 24.79,5.74 25.42,6.37 25.42,16.15 25.04,16.53 v25.04,17.29 | R16.1 9.63,14.88 9.04,14.88 8.78,14.63 8.78,13.99 8.53,13.74 6.43,13.74
SW2
  Top 0.203: U3.10 12.01,19.15 11.45,19.71 11.45,24.53 10.31,25.68 8.53,25.68 8.15,26.06 8.15,35.43 7.9,35.69 S2.1 7.9,35.76 7.9,37.23 8.78,38.12 R17.1
TX  (via drill 0.38 pad 0.76)
  Top 0.203: U3.35 29.02,26.77 28.6,27.2 28.6,29.1 v28.34,29.36
  Bottom 0.203: PROGRAM.P1 26.37,39.58 26.56,39.39 27.2,39.39 28.09,38.5 28.09,29.48 28.22,29.36 v28.34,29.36
VCC  (via drill 0.35, 0.38 pad 0.76)
  Top 0.203: 13.41,29.31 U3.2 13.63,29.23 14.75,29.23 15.26,29.74 20.09,29.74 20.34,29.48 20.34,28.96 | 13.41,29.31 10.88,29.31 C11.1 10.69,29.23 8.66,31.26 8.66,33.55 8.91,33.8 11.71,33.8 13.61,35.71 14.72,35.71 14.75,35.74 | v30.12,37.99 15.13,37.99 14.75,37.61 14.75,35.74 | 14.75,35.74 14.75,35.72 14.77,35.71 v15.64,35.71 | 13.46,29.36 13.41,29.31 | S2.2 5.06,31.23 4.59,30.76 4.59,28.34 6.12,26.82 6.12,19.2 | 20.34,28.96 v20.34,27.33 | v26.44,18.31 26.44,18.56 26.69,18.82 26.69,22.88 v26.31,23.26 | v14.63,4.34 11.07,4.34 7.51,7.9 7.51,9.42 S1.2 6.77,9.28 3.45,12.59 3.45,18.82 3.83,19.2 6.12,19.2 | 6.12,19.2 6.5,18.56 v6.75,18.56 7.6,17.71 R15.1 9.71,16.15 v9.8,16.15 9.93,16.02 10.69,15.39 10.69,13.61 11.45,12.98 15.26,12.98 15.64,13.36 15.64,14.12 15.9,14.37 17.93,14.37 v17.93,14.25 | v19.45,28.98 20.33,28.98 20.34,28.96
  Bottom 0.203: 28.37,23.26 U$5.P$3 28.75,23.25 | C9.1 30.01,18.96 30.5,19.45 30.5,23.23 | 28.75,23.25 30.48,23.25 30.5,23.23 | 30.5,23.23 30.5,33.68 31.39,34.56 31.39,37.41 | 15.73,35.8 R18.1 | 15.73,35.8 v15.64,35.71 | R19.1 32.95,38.25 31.64,38.25 31.39,37.99 31.39,37.62 | 31.39,37.41 31.39,37.62 | 31.38,37.61 31.39,37.62 | S2.2 5.72,31.63 6.63,32.53 6.63,36.47 7.51,37.36 15.13,37.36 15.64,36.85 15.64,35.88 15.73,35.8 | R1.2 R2.2 v6.75,18.56 6.75,18.44 | U$1.8 16.53,27.07 17.04,26.82 18.06,26.82 18.56,27.33 v20.34,27.33 20.34,23.26 19.95,22.87 C4.2 17.93,21.99 13.61,21.99 C1.2 14.23,22.87 14.5,23.14 14.5,24.2 U$1.13 | Q1.2 24.59,15.84 24.28,16.15 24.28,17.8 24.79,18.31 v26.44,18.31 | v26.31,23.26 28.74,23.26 28.75,23.25 | U$8.P3 22.88,2.43 21.87,1.42 17.17,1.42 16.15,2.43 16.15,4.09 15.64,4.47 15.01,4.47 v14.63,4.34 | 7.51,9.42 S1.2 | v30.12,37.99 30.25,37.99 30.76,37.49 31.32,37.49 31.39,37.41 | R3.2 19.87,31.86 20.21,31.52 20.21,29.23 20.09,28.98 v19.45,28.98 19.07,28.6 15.9,28.6 15.01,29.48 13.74,29.48 13.48,29.74 13.48,30.71 | C7.1 11.58,15.26 11.32,15.52 10.56,15.52 v9.8,16.15 | U$2.P$6 20.66,13.61 19.45,13.61 18.69,14.37 18.06,14.37 v17.93,14.25 | 14.33,30.76 U1.6 13.58,30.81 13.48,30.71 | C5.2 17.14,32.11 U1.8 13.57,32.11 13.48,32.02 13.48,30.71
VIBRATION_MOTOR  (via drill 0.35)
  Top 0.203: v23.52,17.29 23.52,16.28 23.26,16.02 20.6,16.02 18.94,14.37 18.94,13.86 18.11,13.03 U3.16
  Bottom 0.203: R10.1 23.05,18.02 23.52,17.55 v23.52,17.29

### Text on the board
tNames: GND/RST/DTR/RX/TX | ON | GND/VCC/SCL/SDA | +
bNames: PROGRAM | GND | RST | DTR | RX | TX | ON | BUZZER | MOTOR | BATT | GND | GND | VCC | SCL | SDA | +